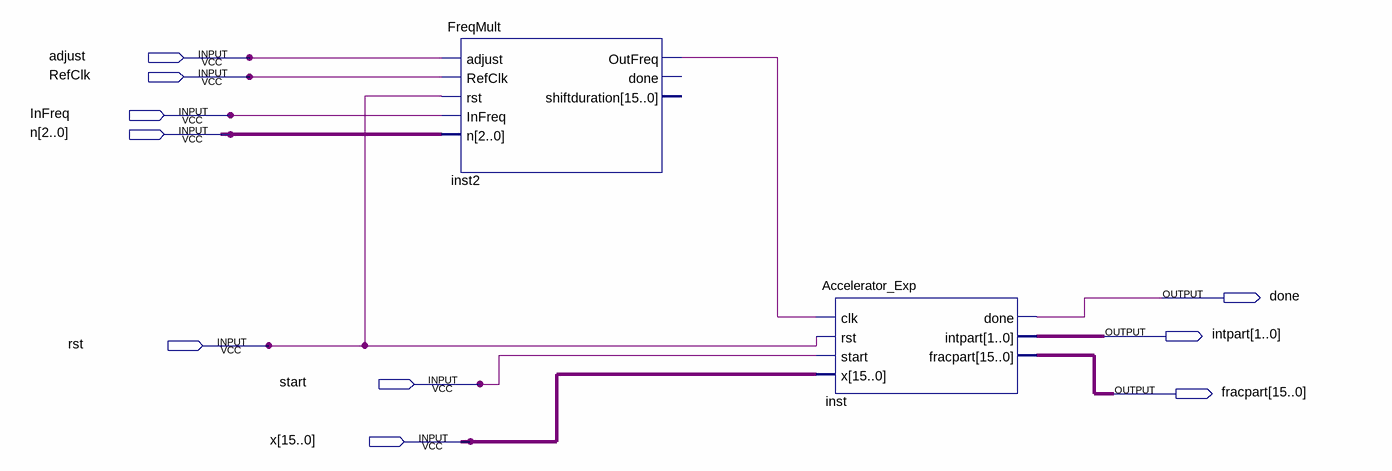
[diagram p0: schematic sheet]
// Quartus schematic Integrated_Circuit.bdf as structural Verilog: 2 symbols, 10 pins
module Integrated_Circuit (
  input  adjust,
  input  RefClk,
  input  InFreq,
  input  [2:0] n,
  input  rst,
  input  start,
  input  [15:0] x,
  output done,
  output [1:0] intpart,
  output [15:0] fracpart
);

  wire inst2_outfreq;

  FreqMult inst2 (
    .adjust(adjust), .RefClk(RefClk), .rst(rst), .InFreq(InFreq), .n(n), .OutFreq(inst2_outfreq));  // open: done, shiftduration
  Accelerator_Exp inst (
    .clk(inst2_outfreq), .rst(rst), .start(start), .x(x), .done(done), .intpart(intpart), .fracpart(fracpart));
endmodule
